# Altium schematic sheet HammerHeadAFE.SchDoc
size C
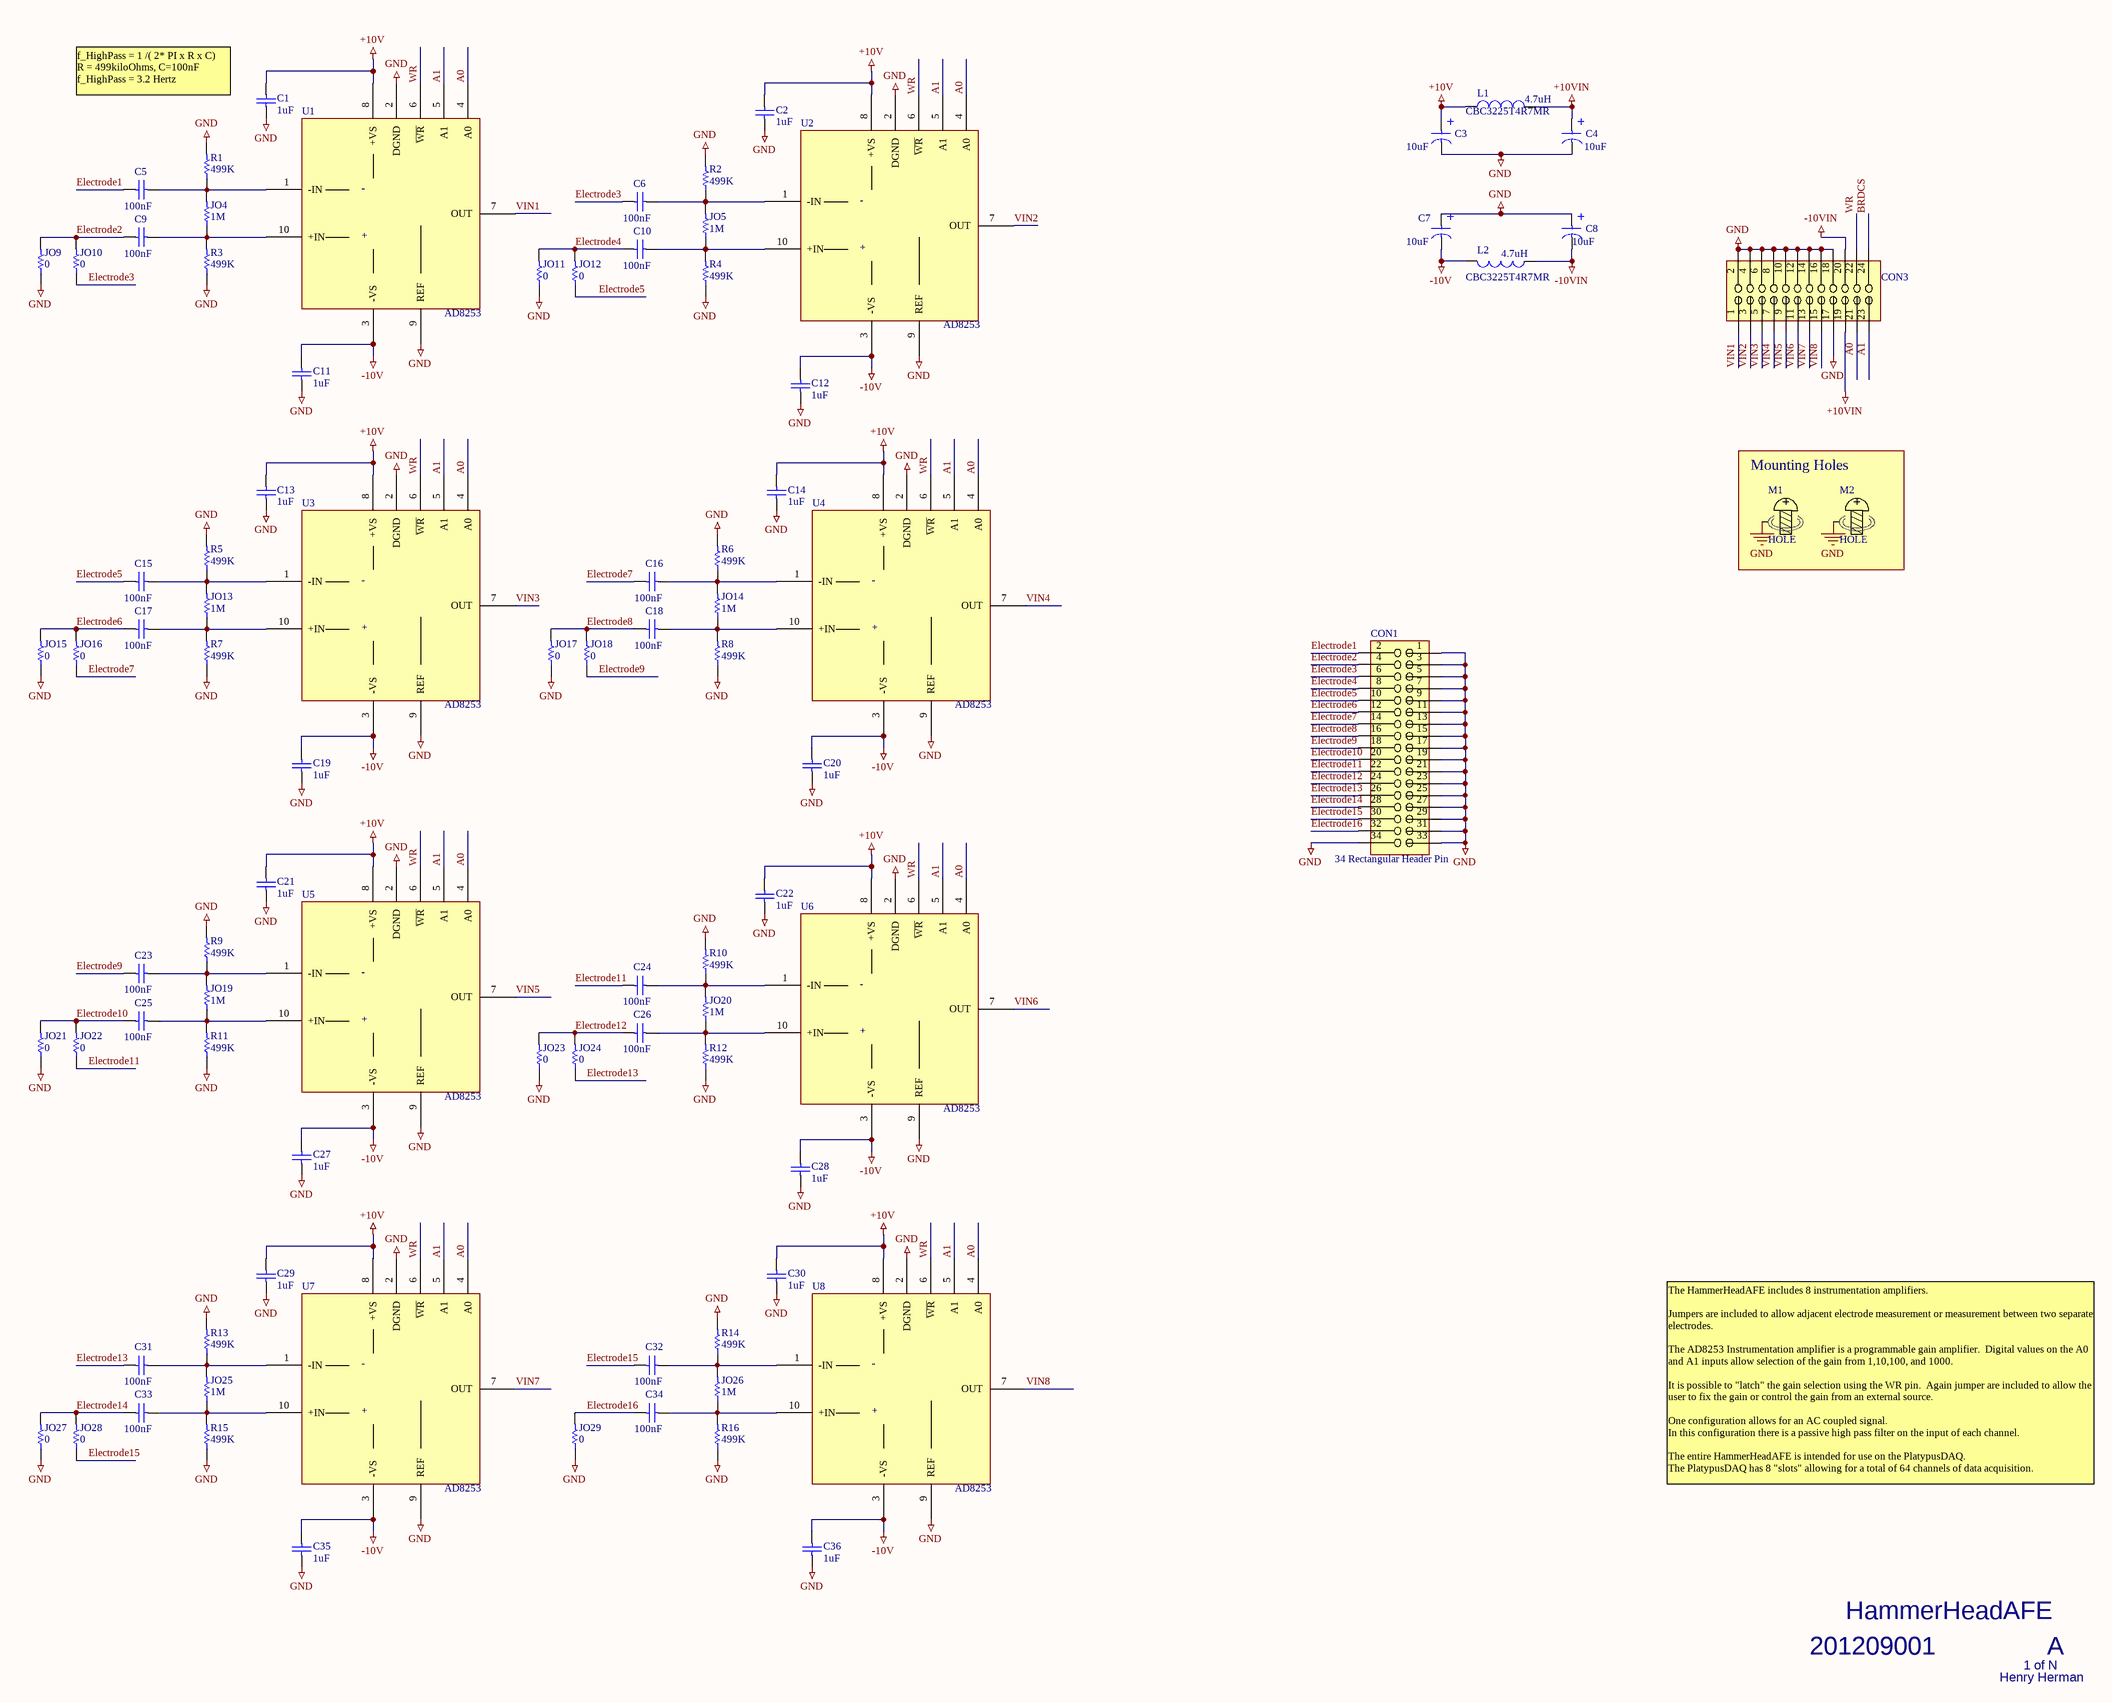
[diagram p0: HammerHeadAFE.SchDoc]

## Parts
C1  CAP  [SM/C_0603]  (value not drawn)
C2  CAP  [SM/C_0603]  (value not drawn)
C3  Label: 10uF  [SM/C_POL_0805]  (hidden comment: CAP_POL)
C4  Label: 10uF  [SM/C_POL_0805]  (hidden comment: CAP_POL)
C5  CAP  [SM/C_0603]  (value not drawn)
C6  CAP  [SM/C_0603]  (value not drawn)
C7  Label: 10uF  [SM/C_POL_0805]  (hidden comment: CAP_POL)
C8  Label: 10uF  [SM/C_POL_0805]  (hidden comment: CAP_POL)
C9  CAP  [SM/C_0603]  (value not drawn)
C10  CAP  [SM/C_0603]  (value not drawn)
C11  CAP  [SM/C_0603]  (value not drawn)
C12  CAP  [SM/C_0603]  (value not drawn)
C13  CAP  [SM/C_0603]  (value not drawn)
C14  CAP  [SM/C_0603]  (value not drawn)
C15  CAP  [SM/C_0603]  (value not drawn)
C16  CAP  [SM/C_0603]  (value not drawn)
C17  CAP  [SM/C_0603]  (value not drawn)
C18  CAP  [SM/C_0603]  (value not drawn)
C19  CAP  [SM/C_0603]  (value not drawn)
C20  CAP  [SM/C_0603]  (value not drawn)
C21  CAP  [SM/C_0603]  (value not drawn)
C22  CAP  [SM/C_0603]  (value not drawn)
C23  CAP  [SM/C_0603]  (value not drawn)
C24  CAP  [SM/C_0603]  (value not drawn)
C25  CAP  [SM/C_0603]  (value not drawn)
C26  CAP  [SM/C_0603]  (value not drawn)
C27  CAP  [SM/C_0603]  (value not drawn)
C28  CAP  [SM/C_0603]  (value not drawn)
C29  CAP  [SM/C_0603]  (value not drawn)
C30  CAP  [SM/C_0603]  (value not drawn)
C31  CAP  [SM/C_0603]  (value not drawn)
C32  CAP  [SM/C_0603]  (value not drawn)
C33  CAP  [SM/C_0603]  (value not drawn)
C34  CAP  [SM/C_0603]  (value not drawn)
C35  CAP  [SM/C_0603]  (value not drawn)
C36  CAP  [SM/C_0603]  (value not drawn)
CON1  34 Rectangular Header Pin  [34Pin-Rectangular Header-SurfaceMount-100milSpacing]
CON3  24pinHeader  [CONN-RECEPT-24PIN]  (value not drawn)
JO4  value 1M  [SM/R_0603]  (hidden comment: Res)
JO5  value 1M  [SM/R_0603]  (hidden comment: Res)
JO9  value 0  [SM/R_0603]  (hidden comment: Res)
JO10  value 0  [SM/R_0603]  (hidden comment: Res)
JO11  value 0  [SM/R_0603]  (hidden comment: Res)
JO12  value 0  [SM/R_0603]  (hidden comment: Res)
JO13  value 1M  [SM/R_0603]  (hidden comment: Res)
JO14  value 1M  [SM/R_0603]  (hidden comment: Res)
JO15  value 0  [SM/R_0603]  (hidden comment: Res)
JO16  value 0  [SM/R_0603]  (hidden comment: Res)
JO17  value 0  [SM/R_0603]  (hidden comment: Res)
JO18  value 0  [SM/R_0603]  (hidden comment: Res)
JO19  value 1M  [SM/R_0603]  (hidden comment: Res)
JO20  value 1M  [SM/R_0603]  (hidden comment: Res)
JO21  value 0  [SM/R_0603]  (hidden comment: Res)
JO22  value 0  [SM/R_0603]  (hidden comment: Res)
JO23  value 0  [SM/R_0603]  (hidden comment: Res)
JO24  value 0  [SM/R_0603]  (hidden comment: Res)
JO25  value 1M  [SM/R_0603]  (hidden comment: Res)
JO26  value 1M  [SM/R_0603]  (hidden comment: Res)
JO27  value 0  [SM/R_0603]  (hidden comment: Res)
JO28  value 0  [SM/R_0603]  (hidden comment: Res)
JO29  value 0  [SM/R_0603]  (hidden comment: Res)
L1  CBC3225T4R7MR  value 4.7uH  [SM/L_0805]
L2  CBC3225T4R7MR  value 4.7uH  [SM/L_0805]
M1  HOLE  [MOUNTING_HOLE-125mil]
M2  HOLE  [MOUNTING_HOLE-125mil]
R1  value 499K  [SM/R_0603]  (hidden comment: Res)
R2  value 499K  [SM/R_0603]  (hidden comment: Res)
R3  value 499K  [SM/R_0603]  (hidden comment: Res)
R4  value 499K  [SM/R_0603]  (hidden comment: Res)
R5  value 499K  [SM/R_0603]  (hidden comment: Res)
R6  value 499K  [SM/R_0603]  (hidden comment: Res)
R7  value 499K  [SM/R_0603]  (hidden comment: Res)
R8  value 499K  [SM/R_0603]  (hidden comment: Res)
R9  value 499K  [SM/R_0603]  (hidden comment: Res)
R10  value 499K  [SM/R_0603]  (hidden comment: Res)
R11  value 499K  [SM/R_0603]  (hidden comment: Res)
R12  value 499K  [SM/R_0603]  (hidden comment: Res)
R13  value 499K  [SM/R_0603]  (hidden comment: Res)
R14  value 499K  [SM/R_0603]  (hidden comment: Res)
R15  value 499K  [SM/R_0603]  (hidden comment: Res)
R16  value 499K  [SM/R_0603]  (hidden comment: Res)
U1  AD8253  [MSOP-10-lead/AnalogDevices]
U2  AD8253  [MSOP-10-lead/AnalogDevices]
U3  AD8253  [MSOP-10-lead/AnalogDevices]
U4  AD8253  [MSOP-10-lead/AnalogDevices]
U5  AD8253  [MSOP-10-lead/AnalogDevices]
U6  AD8253  [MSOP-10-lead/AnalogDevices]
U7  AD8253  [MSOP-10-lead/AnalogDevices]
U8  AD8253  [MSOP-10-lead/AnalogDevices]

## Blocks framed on the sheet
Mounting Holes: M1 M2

## Nets
+10V: C1.1 C2.1 C3.1 C13.1 C14.1 C21.1 C22.1 C29.1 C30.1 L1.1 U1.8(+VS) U2.8(+VS) U3.8(+VS) U4.8(+VS) U5.8(+VS) U6.8(+VS) U7.8(+VS) U8.8(+VS)
+10VIN: C4.1 CON3.19 L1.2
-10V: C7.2 C11.1 C12.1 C19.1 C20.1 C27.1 C28.1 C35.1 C36.1 L2.2 U1.3(-VS) U2.3(-VS) U3.3(-VS) U4.3(-VS) U5.3(-VS) U6.3(-VS) U7.3(-VS) U8.3(-VS)
-10VIN: C8.2 CON3.20 L2.1
GND: C1.2 C2.2 C3.2 C4.2 C7.1 C8.1 C11.2 C12.2 C13.2 C14.2 C19.2 C20.2 C21.2 C22.2 C27.2 C28.2 C29.2 C30.2 C35.2 C36.2 CON1.1 CON1.3 CON1.5 CON1.7 CON1.9 CON1.11 CON1.13 CON1.15 CON1.17 CON1.19 CON1.21 CON1.23 CON1.25 CON1.27 CON1.29 CON1.31 CON1.33 CON1.34 CON3.2 CON3.4 CON3.6 CON3.8 CON3.10 CON3.12 CON3.14 CON3.16 CON3.17 CON3.18 JO9.1 JO11.1 JO15.1 JO17.1 JO21.1 JO23.1 JO27.1 JO29.1 M1.0(PAD) M2.0(PAD) R1.2 R2.2 R3.1 R4.1 R5.2 R6.2 R7.1 R8.1 R9.2 R10.2 R11.1 R12.1 R13.2 R14.2 R15.1 R16.1 U1.2(DGND) U1.9(REF) U2.2(DGND) U2.9(REF) U3.2(DGND) U3.9(REF) U4.2(DGND) U4.9(REF) U5.2(DGND) U5.9(REF) U6.2(DGND) U6.9(REF) U7.2(DGND) U7.9(REF) U8.2(DGND) U8.9(REF)
A0: CON3.21 U1.4(A0) U2.4(A0) U3.4(A0) U4.4(A0) U5.4(A0) U6.4(A0) U7.4(A0) U8.4(A0)
A1: CON3.23 U1.5(A1) U2.5(A1) U3.5(A1) U4.5(A1) U5.5(A1) U6.5(A1) U7.5(A1) U8.5(A1)
BRDCS: CON3.24
Electrode1: C5.1 CON1.2
Electrode2: C9.1 CON1.4 JO9.2 JO10.2
Electrode3: C6.1 CON1.6 JO10.1
Electrode4: C10.1 CON1.8 JO11.2 JO12.2
Electrode5: C15.1 CON1.10 JO12.1
Electrode6: C17.1 CON1.12 JO15.2 JO16.2
Electrode7: C16.1 CON1.14 JO16.1
Electrode8: C18.1 CON1.16 JO17.2 JO18.2
Electrode9: C23.1 CON1.18 JO18.1
Electrode10: C25.1 CON1.20 JO21.2 JO22.2
Electrode11: C24.1 CON1.22 JO22.1
Electrode12: C26.1 CON1.24 JO23.2 JO24.2
Electrode13: C31.1 CON1.26 JO24.1
Electrode14: C33.1 CON1.28 JO27.2 JO28.2
Electrode15: C32.1 CON1.30 JO28.1
Electrode16: C34.1 CON1.32 JO29.2
VIN1: CON3.1 U1.7(OUT)
VIN2: CON3.3 U2.7(OUT)
VIN3: CON3.5 U3.7(OUT)
VIN4: CON3.7 U4.7(OUT)
VIN5: CON3.9 U5.7(OUT)
VIN6: CON3.11 U6.7(OUT)
VIN7: CON3.13 U7.7(OUT)
VIN8: CON3.15 U8.7(OUT)
WR: CON3.22 U1.6(~{WR}) U2.6(~{WR}) U3.6(~{WR}) U4.6(~{WR}) U5.6(~{WR}) U6.6(~{WR}) U7.6(~{WR}) U8.6(~{WR})
NetC5_2: C5.2 JO4.2 R1.1 U1.1(-IN)
NetC6_2: C6.2 JO5.2 R2.1 U2.1(-IN)
NetC9_2: C9.2 JO4.1 R3.2 U1.10(+IN)
NetC10_2: C10.2 JO5.1 R4.2 U2.10(+IN)
NetC15_2: C15.2 JO13.2 R5.1 U3.1(-IN)
NetC16_2: C16.2 JO14.2 R6.1 U4.1(-IN)
NetC17_2: C17.2 JO13.1 R7.2 U3.10(+IN)
NetC18_2: C18.2 JO14.1 R8.2 U4.10(+IN)
NetC23_2: C23.2 JO19.2 R9.1 U5.1(-IN)
NetC24_2: C24.2 JO20.2 R10.1 U6.1(-IN)
NetC25_2: C25.2 JO19.1 R11.2 U5.10(+IN)
NetC26_2: C26.2 JO20.1 R12.2 U6.10(+IN)
NetC31_2: C31.2 JO25.2 R13.1 U7.1(-IN)
NetC32_2: C32.2 JO26.2 R14.1 U8.1(-IN)
NetC33_2: C33.2 JO25.1 R15.2 U7.10(+IN)
NetC34_2: C34.2 JO26.1 R16.2 U8.10(+IN)

## Notes on the sheet
- (near C1) f_HighPass = 1 /( 2* PI x R x C)
  R = 499kiloOhms, C=100nF
  f_HighPass = 3.2 Hertz
- The HammerHeadAFE includes 8 instrumentation amplifiers.
  Jumpers are included to allow adjacent electrode measurement or measurement between two separate electrodes.
  The AD8253 Instrumentation amplifier is a programmable gain amplifier.  Digital values on the A0 and A1 inputs allow selection of the gain from 1,10,100, and 1000.
  It is possible to "latch" the gain selection using the WR pin.  Again jumper are included to allow the user to fix the gain or control the gain from an external source.
  One configuration allows for an AC coupled signal.
  In this configuration there is a passive high pass filter on the input of each channel.
  The entire HammerHeadAFE is intended for use on the PlatypusDAQ.
  The PlatypusDAQ has 8 "slots" allowing for a total of 64 channels of data acquisition.
- HammerHeadAFE
- 201209001
- Henry Herman
- 1 of N
- A
- (in symbol AD8253) -; +

## Library data of the parts
C1 C2 C11-C14 C19-C22 C27-C30 C35 C36 = CAP: 1uF; Label: 1uF; Value: 1uF
C3 C4 C7 C8 = CAP_POL: CAP; Value: 10uF
C5 C6 C9 C10 C15-C18 C23-C26 C31-C34 = CAP: 100nF; Label: 100nF; Value: 100nF
CON1 = 34pinHeader
JO4 JO5 JO13 JO14 JO19 JO20 JO25 JO26 = Res: Resistor 1M; Published: 8-Jun-2000; LatestRevisionDate: 17-Jul-2002; LatestRevisionNote: Re-released for DXP Platform.; PackageReference: AXIAL-0.3; Publisher: Altium Limited
JO9-JO12 JO15-JO18 JO21-JO24 JO27-JO29 R1-R16 = Res: Resistor; Published: 8-Jun-2000; LatestRevisionDate: 17-Jul-2002; LatestRevisionNote: Re-released for DXP Platform.; PackageReference: AXIAL-0.3; Publisher: Altium Limited
L1 L2 = Inductor
M1 M2 = MountingHole